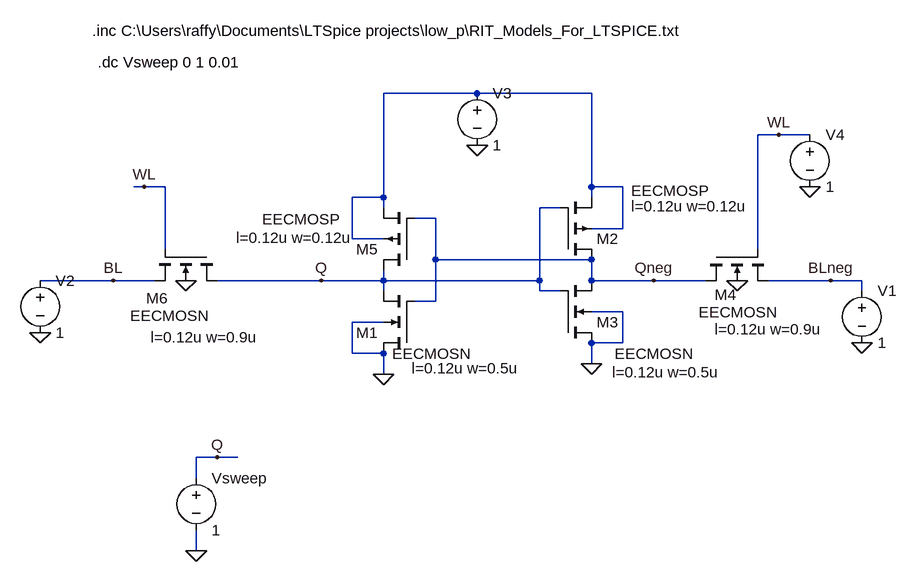
[diagram p0: schematic 6tcell.asc]
6tcell.asc, the LTspice schematic file:
Version 4
SHEET 1 1272 836
WIRE 624 112 480 112
WIRE 800 112 624 112
WIRE 1088 176 1056 176
WIRE 1136 176 1088 176
WIRE 112 256 96 256
WIRE 144 256 112 256
WIRE 800 256 800 112
WIRE 848 256 800 256
WIRE 480 272 480 112
WIRE 480 272 432 272
WIRE 800 272 800 256
WIRE 480 288 480 272
WIRE 752 288 720 288
WIRE 560 304 528 304
WIRE 848 320 848 256
WIRE 848 320 800 320
WIRE 432 336 432 272
WIRE 480 336 432 336
WIRE 144 352 144 256
WIRE 1056 352 1056 176
WIRE 560 368 560 304
WIRE 800 368 560 368
WIRE 64 400 -48 400
WIRE 128 400 64 400
WIRE 384 400 224 400
WIRE 480 400 480 384
WIRE 480 400 384 400
WIRE 720 400 720 288
WIRE 720 400 480 400
WIRE 800 400 800 368
WIRE 896 400 800 400
WIRE 976 400 896 400
WIRE 1168 400 1072 400
WIRE 1216 400 1168 400
WIRE 480 416 480 400
WIRE 720 416 720 400
WIRE 752 416 720 416
WIRE 1216 416 1216 400
WIRE 560 432 560 368
WIRE 560 432 528 432
WIRE 848 448 800 448
WIRE 480 464 432 464
WIRE 848 496 848 448
WIRE 848 496 800 496
WIRE 432 512 432 464
WIRE 480 512 432 512
WIRE 800 528 800 496
WIRE 480 544 480 512
WIRE 224 672 192 672
WIRE 256 672 224 672
WIRE 192 704 192 672
WIRE 192 816 192 784
FLAG 192 816 0
FLAG 224 672 Q
FLAG 112 256 WL
FLAG 624 192 0
FLAG 480 544 0
FLAG 800 528 0
FLAG 384 400 Q
FLAG 1216 496 0
FLAG 896 400 Qneg
FLAG 1136 256 0
FLAG 1088 176 WL
FLAG 1168 400 BLneg
FLAG 64 400 BL
FLAG -48 480 0
FLAG 176 400 0
FLAG 1024 400 0
SYMBOL voltage 1216 400 R0
WINDOW 123 0 0 Left 0
WINDOW 39 0 0 Left 0
SYMATTR InstName V1
SYMATTR Value 1
SYMBOL voltage -48 384 R0
WINDOW 123 0 0 Left 0
WINDOW 39 0 0 Left 0
SYMATTR InstName V2
SYMATTR Value 1
SYMBOL voltage 192 688 R0
WINDOW 123 0 0 Left 0
WINDOW 39 0 0 Left 0
SYMATTR InstName Vsweep
SYMATTR Value 1
SYMBOL voltage 624 96 R0
WINDOW 123 0 0 Left 0
WINDOW 39 0 0 Left 0
SYMATTR InstName V3
SYMATTR Value 1
SYMBOL voltage 1136 160 R0
WINDOW 123 0 0 Left 0
WINDOW 39 0 0 Left 0
SYMATTR InstName V4
SYMATTR Value 1
SYMBOL pmos4 528 384 R180
WINDOW 3 115 78 Left 2
WINDOW 123 95 50 Left 2
SYMATTR Value EECMOSP
SYMATTR Value2 l=0.12u w=0.12u
SYMATTR InstName M5
SYMBOL pmos4 752 368 M180
WINDOW 3 109 106 Left 2
WINDOW 123 109 82 Left 2
SYMATTR Value EECMOSP
SYMATTR Value2 l=0.12u w=0.12u
SYMATTR InstName M2
SYMBOL nmos4 224 352 R90
WINDOW 0 75 75 VRight 2
WINDOW 3 102 13 VRight 2
WINDOW 123 135 -64 VRight 2
SYMATTR InstName M6
SYMATTR Value EECMOSN
SYMATTR Value2 l=0.12u w=0.9u
SYMBOL nmos4 528 512 R180
WINDOW 3 -86 -1 Left 2
WINDOW 123 -161 -23 Left 2
SYMATTR Value EECMOSN
SYMATTR Value2 l=0.12u w=0.5u
SYMATTR InstName M1
SYMBOL nmos4 752 496 M180
WINDOW 3 84 -17 Left 2
WINDOW 123 80 -45 Left 2
SYMATTR Value EECMOSN
SYMATTR Value2 l=0.12u w=0.5u
SYMATTR InstName M3
SYMBOL nmos4 976 352 M90
WINDOW 0 70 47 VLeft 2
WINDOW 3 97 110 VLeft 2
WINDOW 123 123 179 VLeft 2
SYMATTR InstName M4
SYMATTR Value EECMOSN
SYMATTR Value2 l=0.12u w=0.9u
TEXT 32 16 Left 2 !.inc C:\\Users\\raffy\\Documents\\LTSpice projects\\low_p\\RIT_Models_For_LTSPICE.txt
TEXT 40 64 Left 2 !.dc Vsweep 0 1 0.01

The netlist it stands for:
* 6tcell.asc
V1 BLneg 0 1
V2 BL 0 1
Vsweep Q 0 1
V3 N001 0 1
V4 WL 0 1
M5 Q Qneg N001 N001 EECMOSP l=0.12u w=0.12u
M2 Qneg Q N001 N001 EECMOSP l=0.12u w=0.12u
M6 Q WL BL 0 EECMOSN l=0.12u w=0.9u
M1 0 Qneg Q 0 EECMOSN l=0.12u w=0.5u
M3 0 Q Qneg 0 EECMOSN l=0.12u w=0.5u
M4 Qneg WL BLneg 0 EECMOSN l=0.12u w=0.9u
.model NMOS NMOS
.model PMOS PMOS
.lib standard.mos
.inc C:\Users\raffy\Documents\LTSpice projects\low_p\RIT_Models_For_LTSPICE.txt
.dc Vsweep 0 1 0.01
.backanno
.end